# Altium schematic sheet bq RepRap LCD SmartController_ConAdap.SchDoc: Connector Adapter for LCD
size A4; Author: Juan Jose Vicente; CompanyName: bq - Mundo Reader; Organization: bq - Mundo Reader; Revision: 1.5; SheetNumber: 1; SheetTotal: 1
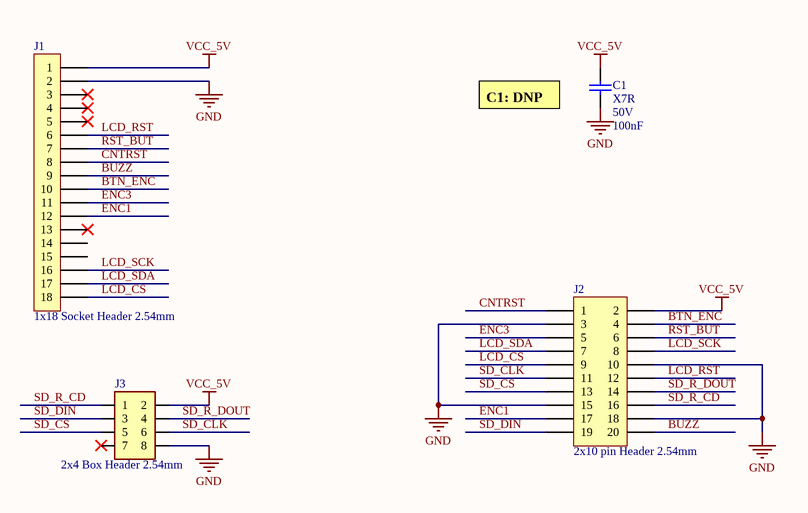
[diagram p0: bq RepRap LCD SmartController_ConAdap.SchDoc]

## Parts
C1  Dielectric: X7R  Voltage: 50V  Capacitance: 100nF  [CAP5,50x3,50]  (hidden comment: Capacitor)
J1  1x18 Socket Header 2.54mm  [1x18 Socket Header THT 2.54mm]
J2  2x10 pin Header 2.54mm  [2x10 pin Header 2.54]
J3  2x4 Box Header 2.54mm  [2x4 Box Header THD 2.54mm]

## Nets
GND: C1.1 J1.2 J2.3 J2.10 J2.15 J2.18 J3.8
VCC_5V: C1.2 J1.1 J2.2 J3.2
BTN_ENC: J1.10 J2.4
BUZZ: J1.9 J2.20
CNTRST: J1.8 J2.1
ENC1: J1.12 J2.17
ENC3: J1.11 J2.5
LCD_CS: J1.18 J2.9
LCD_RST: J1.6 J2.12
LCD_SCK: J1.16 J2.8
LCD_SDA: J1.17 J2.7
RST_BUT: J1.7 J2.6
SD_CLK: J2.11 J3.6
SD_CS: J2.13 J3.5
SD_DIN: J2.19 J3.3
SD_R_CD: J2.16 J3.1
SD_R_DOUT: J2.14 J3.4

Not connected (* = marked no-connect by the designer): J1 3* 4* 5* 13* 14 15; J3 7*

## Notes on the sheet
- (near C1) C1: DNP
- Title
- Project
- Size:
- Author
- A4
- Number:
- Revision:
- Mundo Reader, S.L. This project and all the sheets and layouts enclosed are licensed under Creative Commons by Attribution and Share Alike [CC BY-SA] (www.creativecommons.com)
- Date:
- Time:
- Sheet
- of

## Library data of the parts
C1 = 100nF_50V_±10%: Manufacturer: Kemet; Value: 100nF ±10% 50V; Tolerance: ±10%; OrderingCode: C320C104K5R5TA; Temp_ Max: 125; Temp_ Min: -55; OrderingCode 2: SR205C104KAA; Part Number: 100nF_50V_±10%; Price (€): 0,04; Manufacturer 2: AVX
J1 = CON_SH_THT2.54_18: Connector, 18 pin Socket Header 2.54mm; Manufacturer: Samtec; OrderingCode: SSW-118-01-T-S; Temp_ Max: 125; Temp_ Min: -40; OrderingCode 2: 613 018 118 21; Value: 18; Pitch: 2.54mm; Part Number: CON_SH_THT2.54_18; Supplier: Samtec; Price (€): 0,93; Manufacturer 2: Würth Elektronik
J2 = CON_DPH_THT2.54_20: 20 pin Dual Header 2.54mm; Manufacturer: Samtec; OrderingCode: TSW-110-07-T-D; Temp_ Max: 125; Temp_ Min: -40; OrderingCode 2: 613 020 211 21; Value: 20; Pitch: 2.54mm; Part Number: CON_DPH_THT2.54_20; Supplier: Samtec; Manufacturer 2: Würth Elektronik; Price (€): 0,617
J3 = CON_DBH_THD_2.54_8: Connector, 8 Pin Box Dual Header 2.54mm; Manufacturer: Samtec; OrderingCode: SSW-104-01-L-D; Temp_ Max: 125; Temp_ Min: -40; OrderingCode 2: 613 008 218 21; Value: 8; Part Number: CON_DBH_THD_2.54_8; Supplier: Wurth; Manufacturer 2: Wurth Elektronik